# EAGLE design SkyKontrol-datalogger (EAGLE 9.5.2)
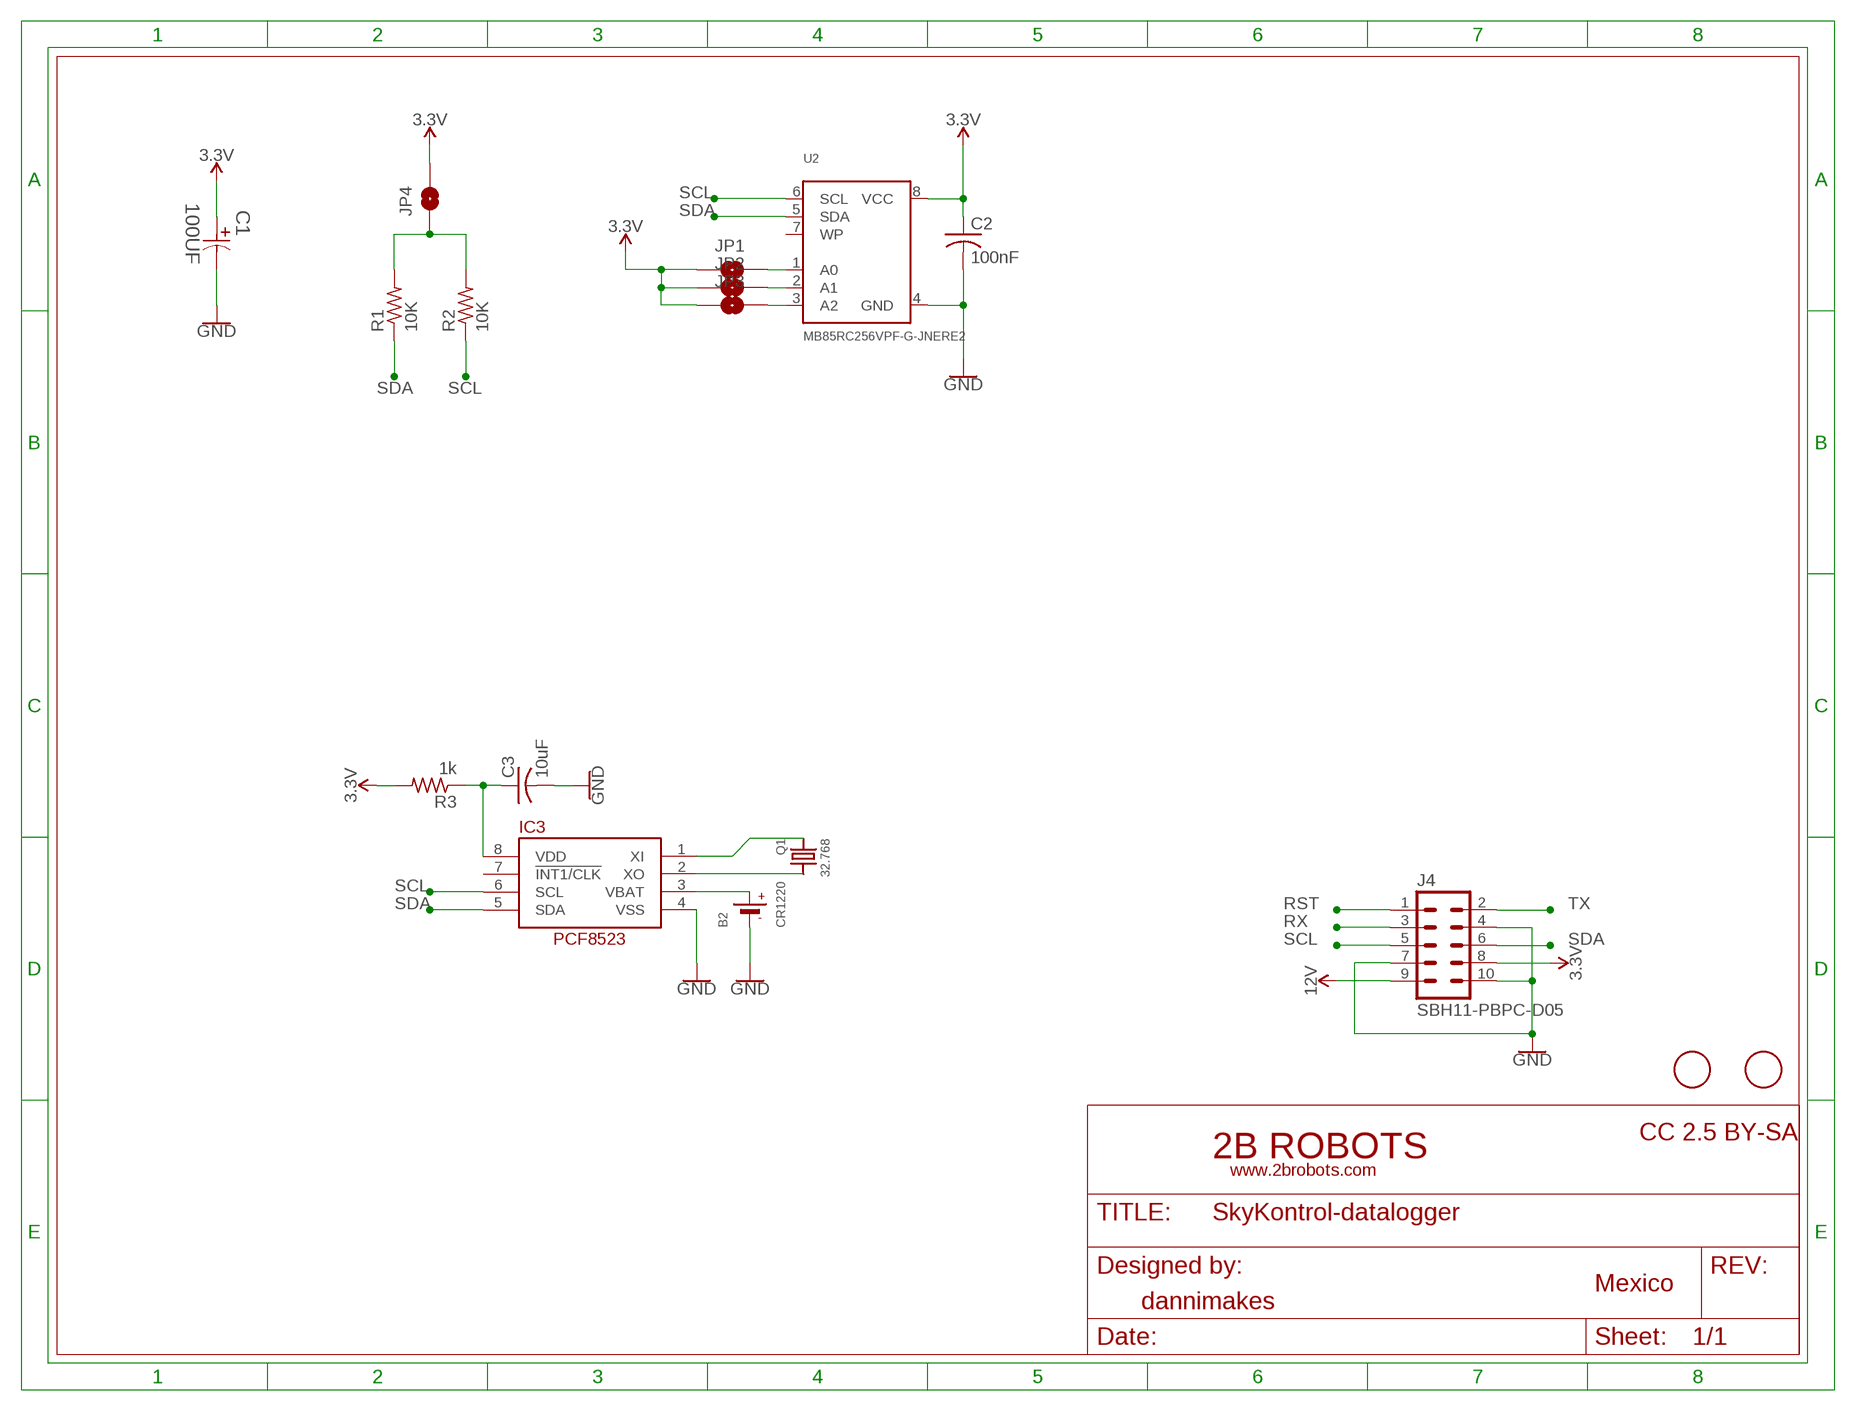
[diagram p0: schematic, sheet 1]

## Parts
B2  CR1220  BATTERYCR1220_SMT  [CR1220]
C1  100UF  EEE-HA1E101XP-CASE-D8  [CAPAE660X800N]
C2  100nF  C-USC0603K  [C0603K]
C3  10uF  C-USC0805K  [C0805K]
IC3  RTC_PCF8523T  [SOIC8_150MIL]
J4  SBH11-PBPC-D05  [SBH11-PBPC-D05]
JP1  JUMPER-SMT_2_NO_SILK  [SMT-JUMPER_2_NO_SILK]
JP2  JUMPER-SMT_2_NO_SILK  [SMT-JUMPER_2_NO_SILK]
JP3  JUMPER-SMT_2_NO_SILK  [SMT-JUMPER_2_NO_SILK]
JP4  JUMPER-SMT_2_NO_SILK  [SMT-JUMPER_2_NO_SILK]
Q1  32.768  CRYSTAL8.0X3.8  [CRYSTAL_8X3.8]
R1  10K  R-US_R0805  [R0805]
R2  10K  R-US_R0805  [R0805]
R3  1k  R-US_R0805  [R0805]
U2  MB85RC256VPF-G-JNERE2  FRAM_SOIC8_I2C  [SOIC8_208MIL]
U$1  FIDUCIAL  [FIDUCIAL_1MM]
U$3  FIDUCIAL  [FIDUCIAL_1MM]

## Nets
3.3V: C1.1 C2.1 J4.8 JP1.1 JP2.1 JP3.1 JP4.2 R3.2 U2.8(VCC)
12V: J4.9
GND: B2.- C1.2 C2.2 C3.2 IC3.4(VSS) J4.4 J4.7 J4.10 U2.4(GND)
N$1: JP1.2 U2.1(A0)
N$2: JP2.2 U2.2(A1)
N$3: C3.1 IC3.8(VDD) R3.1
N$4: JP3.2 U2.3(A2)
N$8: JP4.1 R1.2 R2.2
N$14: IC3.1(XI) Q1.P$1
N$15: IC3.2(XO) Q1.P$4
RST: J4.1
RX: J4.3
SCL: IC3.6(SCL) J4.5 R2.1 U2.6(SCL)
SDA: IC3.5(SDA) J4.6 R1.1 U2.5(SDA)
TX: J4.2
VBAT1: B2.+$1(+) IC3.3(VBAT)
Unconnected: IC3.7(!INT1/CLK) U2.7(WP)

## Library data of the parts
B2 = microbuilder:BATTERY: CR1220 SMT - Digikey: 3001K-ND CD2032 BAT-HLD-001 - Digikey: BAT-HLD-001-ND
C1 = Panasonic-EEEFT_EEEH:EEE-: Aluminum Electrolytic Capacitors,Surface Mount Type; MPN: EEE-HA1E101XP; OC_FARNELL: 1973328; OC_NEWARK: 58T9236; PACKAGE: CASE-D8; SUPPLIER: PANASONIC; TOLERANCE: ±20 %; VOLTAGERATING: 25V
C2 C3 = adafruit:C-US: CAPACITOR, American symbol
IC3 = microbuilder:RTC_PCF8523
J4 = con-sullins:SBH11-PBPC-D05: HEADER - Vertical, Shrouded
JP1-JP4 = SparkFun-Jumpers:JUMPER-SMT_2_NO: Normally open jumper This jumper has two pads in close proximity to each other. Apply solder to close the connection. Round pads are easier to solder for beginners, but are a lot larger. SparkFun Product that uses the round pads: SparkFun EL Sequencer <https://www.sparkfun.com/products/12781>
Q1 = microbuilder:CRYSTAL: Crystals HC49UP - Surface Mount Crystal 4.0MHz 18pF +/-30ppm Surface Mount Crystal [Digikey: 535-9857-1-ND] 12.0 MHz Surface Mount Crystal [Digikey: 535-9869-6-ND] 25.0 MHz Surface Mount Crystal [Digikey: 535-9078-1-ND] 2.5 x 2.0mm - MEMs SMT Crystal 16.0 MHz 10pF 20ppm 2.5 x 2.0mm Crystal [Digikey -40-85°C: 535-10923-1-ND] 3.2 x 2.5mm - MEMs SMT Crystal 12.0 MHz 8pF 15ppm 3.2 x 2.5mm Crystal [Digikey: -10-70°C: 644-1047-1-ND -40-125°C: 644-1128-1-ND] 40~85°C cheaper: 644-1173-6-ND 16.0 MHz 8pF 15ppm 3.2 x 2.5mm Crystal [Digikey: -10-70°C: 644-1049-1-ND -40-125°C: 644-1129-2-ND]-40~85°C cheaper: 644-1175-6-ND 16.0 MHz 10pF 10ppm 3.2 x 2.5mm Crystal [Digikey: 644-1100-1-ND] 27.12 MHz 18pF 30ppm 3.2 x 2.5mm Crystal [Digikey: 887-1424-1-ND] 27.12MHz 10pF 10ppm 3.2 x 2.5mm Crystal [Digikey: 887-1329-1-ND] 4.9 x 1.8mm - MEMs SMT Crystal 32.768 KHz 12.5pF 20ppm 4.9 x 1.8mm Crystal [Digikey: SE2415CT-ND] 8.0 x 3.8mm - Surface Mount Crystal 32.768kHz 12.5pF 20ppm -40°C-85°C [Digikey: 535-9166-2-ND] Cylinder 32.768KHz Cylinder Crystal (2x6mm body) [Ex. Digikey: 300-8341-2-ND]
R1-R3 = adafruit:R-US_: RESISTOR, American symbol
U2 = microbuilder:FRAM_SOIC8_I2C: I2C FRAM - SOIC8 Package 256KBit (32Kx8) - MB85RC256VPF-G-JNERE2 - SOIC-8 200 Mil, 2.7-5.5V, -40°C-85°C
U$1 U$3 = adafruit:FIDUCIAL: For use by pick and place machines to calibrate the vision/machine, 1mm By microbuilder.eu

## Board
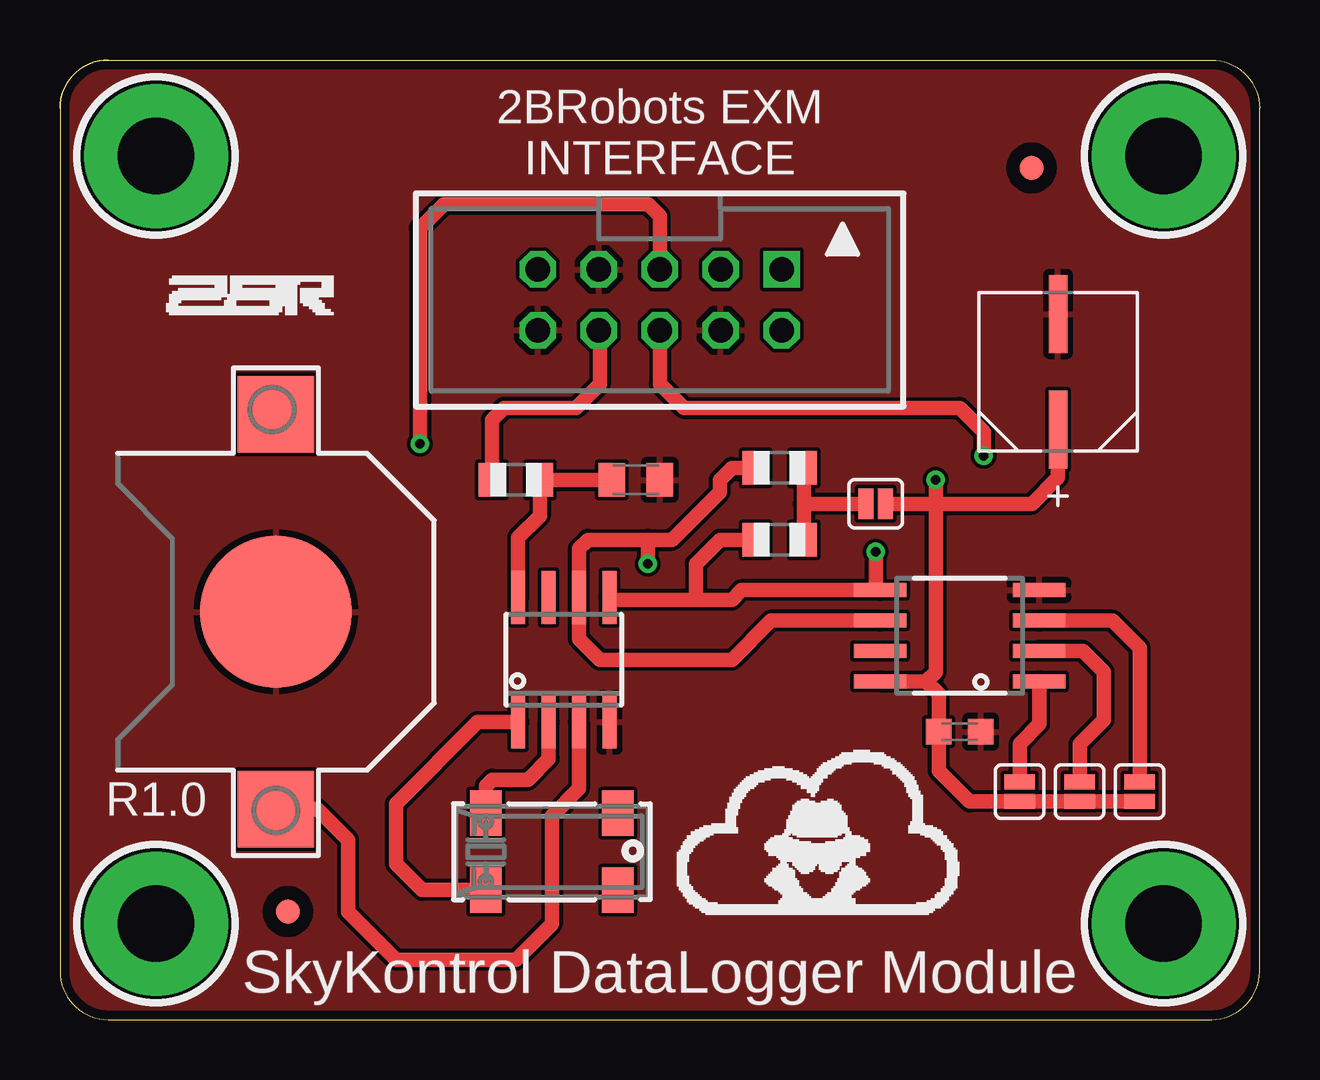
[diagram p1: board, top side]
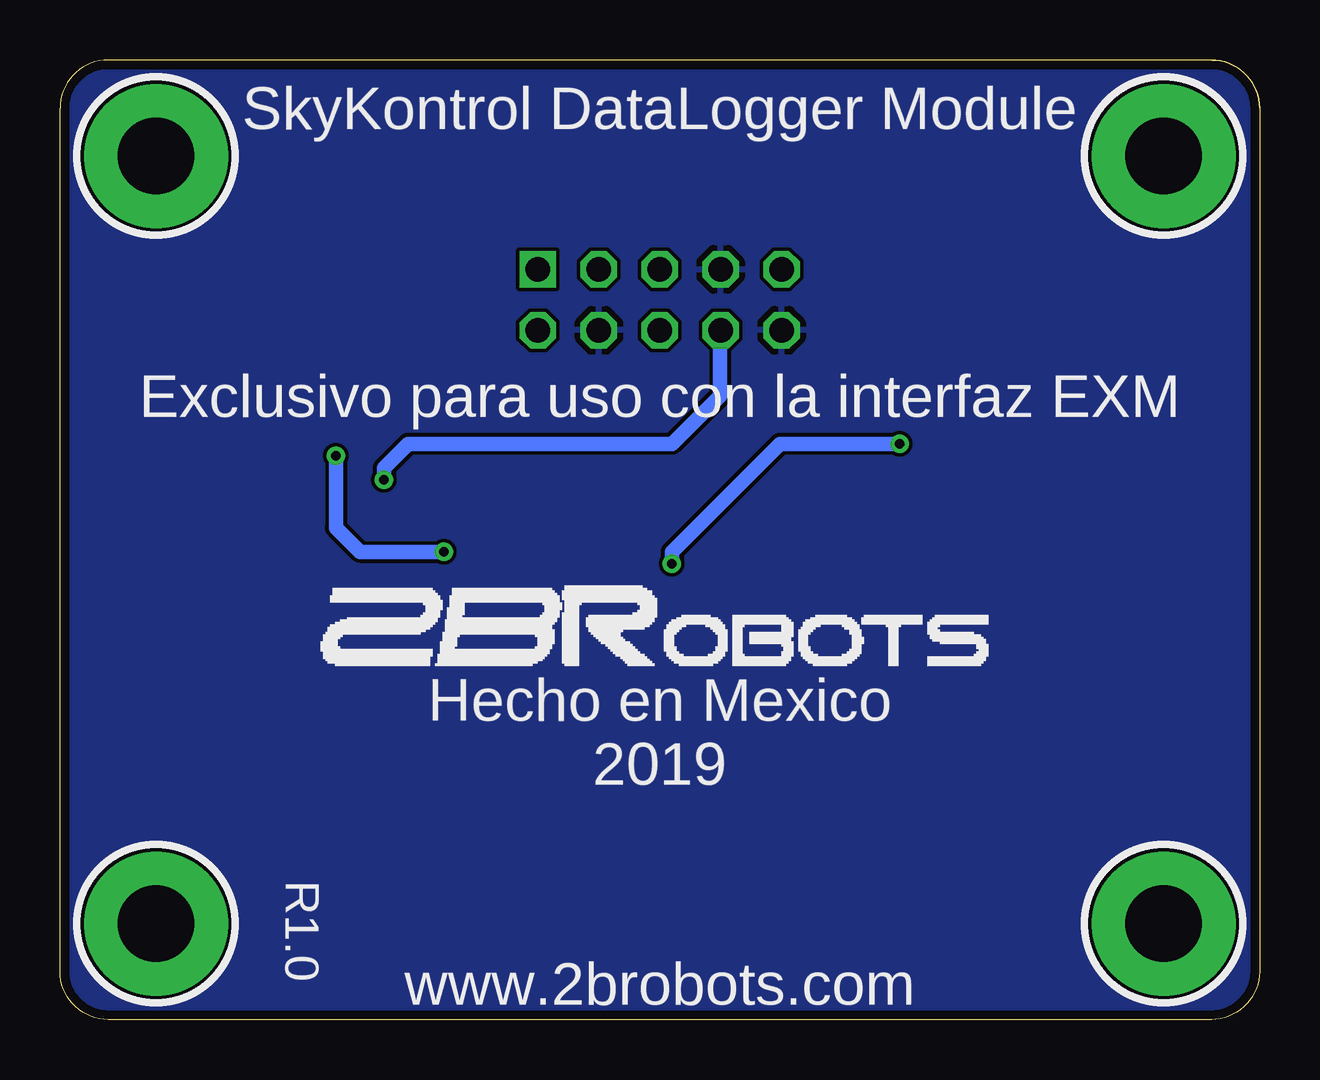
[diagram p2: board, bottom side, seen from below]

Size 50 x 40 mm. Coordinates in mm from the lower left corner, seen from the top.
Outline: 0,38 0,2 arc90 2,0 48,0 arc90 50,2 50,38 arc90 48,40 2,40
Outline: 2,40 arc90 0,38
Outline: 0,38 arc-90 2,40
Copper layers (1*16): Top 0.0356mm / dielectric 1.5011mm / Bottom 0.0356mm
Design rules "2brobots-2layer": minimum track width 6mil, minimum drill 0.3mm, track to track 6mil, track to pad 6mil, pad to pad 6mil, via to via 6mil, smd to smd 6mil, copper to edge 15mil, drill to drill 6mil, minimum pad ring 7mil, minimum via ring 7mil, stop-mask expansion 2.5mil, vias tented up to drill 50mil, thermal gap 10mil

### Footprints (pad centres in the part's own frame; a part is rotated, then mirrored left to right if it is on the bottom)
CR1220 = smd 3.2 x 3.2: +$1 -8.225,0; +$2 8.225,0 | smd 6.35 x 6.35: - 0,0
CAPAE660X800N = smd 3.251 x 0.762: 1 -2.413,0; 2 2.413,0
C0603K = smd 1.05 x 1.08: 1 -0.875,0; 2 0.875,0
C0805K = smd 1.1 x 1.4: 1 -1,0; 2 1,0
SOIC8_150MIL = smd 0.6 x 2.2: 1 -1.905,-2.6; 2 -0.635,-2.6; 3 0.635,-2.6; 4 1.905,-2.6; 5 1.905,2.6; 6 0.635,2.6; 7 -0.635,2.6; 8 -1.905,2.6
SBH11-PBPC-D05 = drill 1.016 square: 1 -5.08,-1.27 | drill 1.016 octagon: 2 -5.08,1.27; 3 -2.54,-1.27; 4 -2.54,1.27; 5 0,-1.27; 6 0,1.27; 7 2.54,-1.27; 8 2.54,1.27; 9 5.08,-1.27; 10 5.08,1.27
SMT-JUMPER_2_NO_SILK = smd 0.635 x 1.27: 1 -0.406,0; 2 0.406,0
CRYSTAL_8X3.8 = smd 1.3 x 1.9: P$1 -2.75,-1.6; P$2 2.75,-1.6; P$3 2.75,1.6; P$4 -2.75,1.6
R0805 = smd 1.1 x 1.4: 1 -1,0; 2 1,0
SOIC8_208MIL = smd 0.6 x 2.2: 1 -1.905,-3.315; 2 -0.635,-3.315; 3 0.635,-3.315; 4 1.905,-3.315; 5 1.905,3.315; 6 0.635,3.315; 7 -0.635,3.315; 8 -1.905,3.315
FIDUCIAL_1MM = smd 1 x 1: 1 0,0

### Placement (x,y rotation side)
B2  9,17 90 top
C1  41.6,27 90 top
C2  37.5,12 0 top
C3  24,22.5 0 top
IC3  21,15 0 top
J4  25,30 180 top
JP1  40,9.5 90 top
JP2  42.5,9.5 90 top
JP3  45,9.5 90 top
JP4  34,21.5 0 top
Q1  20.5,7 0 top
R1  30,20 0 top
R2  30,23 0 top
R3  19,22.5 180 top
U2  37.5,16 90 top
U$1  9.5,4.5 0 top
U$3  40.5,35.5 0 top

### Tracks (layer width: path | path; a pad name or v marks a point on that pad's centre or on a via)
3.3V  (via drill 0.4)
  Top 0.61: J4.8 22.5,28.69 22.5,26.5 21.5,25.5 18.5,25.5 18,25 R3.2 | v36.5,22.5 36.5,21.5 | JP4.2 36.5,21.5 | 36.5,21.5 40.5,21.5 41.6,22.6 C1.1 | U2.8 36.09,14.1 | 36.09,14.1 36.5,14.5 36.5,21.5 | 36.09,14.1 36.62,13.56 C2.1 36.62,10.38 37.91,9.09 JP1.1 JP2.1 JP3.1
  Bottom 0.61: J4.8 22.5,28.69 22.5,26 24.5,24 35.5,24 36.5,23 v36.5,22.5
GND
  pour Top: 0,0 50,0 50,40 0,40
  pour Bottom: 0,0 50,0 50,40 0,40
N$1
  Top 0.61: JP1.2 40,11.5 40.81,12.31 U2.1
N$2
  Top 0.61: JP2.2 42.5,11.5 43.5,12.5 43.5,14.5 42.63,15.37 U2.2
N$3
  Top 0.61: C3.1 R3.1 20,21 19.09,20.09 IC3.8
N$4
  Top 0.61: JP3.2 45,15.5 43.87,16.64 U2.3
N$5  (via drill 3.2 pad 6)
  other vias: 46,36
N$6  (via drill 3.2 pad 6)
  other vias: 4,36
N$7  (via drill 3.2 pad 6)
  other vias: 4,4
N$8
  Top 0.61: JP4.1 31,21.5 | R2.2 31,21.5 | 31,21.5 R1.2
N$11  (via drill 3.2 pad 6)
  other vias: 46,4
N$14
  Top 0.61: Q1.P$1 15.1,5.4 14,6.5 14,9 17.4,12.4 IC3.1
N$15
  Top 0.61: Q1.P$4 17.75,9.75 18,10 19.5,10 20.36,10.87 IC3.2
SCL  (via drill 0.4)
  Top 0.61: U2.6 29.64,16.64 28,15 22.5,15 21.64,15.87 IC3.6 21.64,19.64 22,20 24.5,20 | R2.1 28,23 27.5,22.5 27.5,22 25.5,20 24.5,20 | J4.5 25,33.5 24.5,34 16,34 15,33 v15,24 | v24.5,19 24.5,20
  Bottom 0.61: v15,24 20,24 24.5,19.5 v24.5,19
SDA  (via drill 0.4)
  Top 0.61: 26.5,17.5 28,17.5 28.41,17.91 U2.5 34,18.09 v34,19.5 | 26.5,17.5 23,17.5 IC3.5 | R1.1 27.5,20 26.5,19 26.5,17.5 | J4.6 25,26.5 26,25.5 37.5,25.5 38.5,24.5 v38.5,23.5
  Bottom 0.61: v38.5,23.5 38.5,20.5 37.5,19.5 v34,19.5
VBAT1
  Top 0.61: IC3.3 21.64,9.63 20.5,8.5 20.5,4 19,2.5 14,2.5 12,4.5 12,7.5 10.72,8.78 B2.+$1

### Text on the board
tPlace: 2BRobots EXM / INTERFACE | R1.0 | SkyKontrol DataLogger Module
bPlace: SkyKontrol DataLogger Module | Exclusivo para uso con la interfaz EXM | Hecho en Mexico / 2019 | R1.0 | www.2brobots.com
tStop: www.2brobots.com